# Altium schematic sheet Power.SchDoc
size A4; SheetNumber: 4; SheetTotal: 11
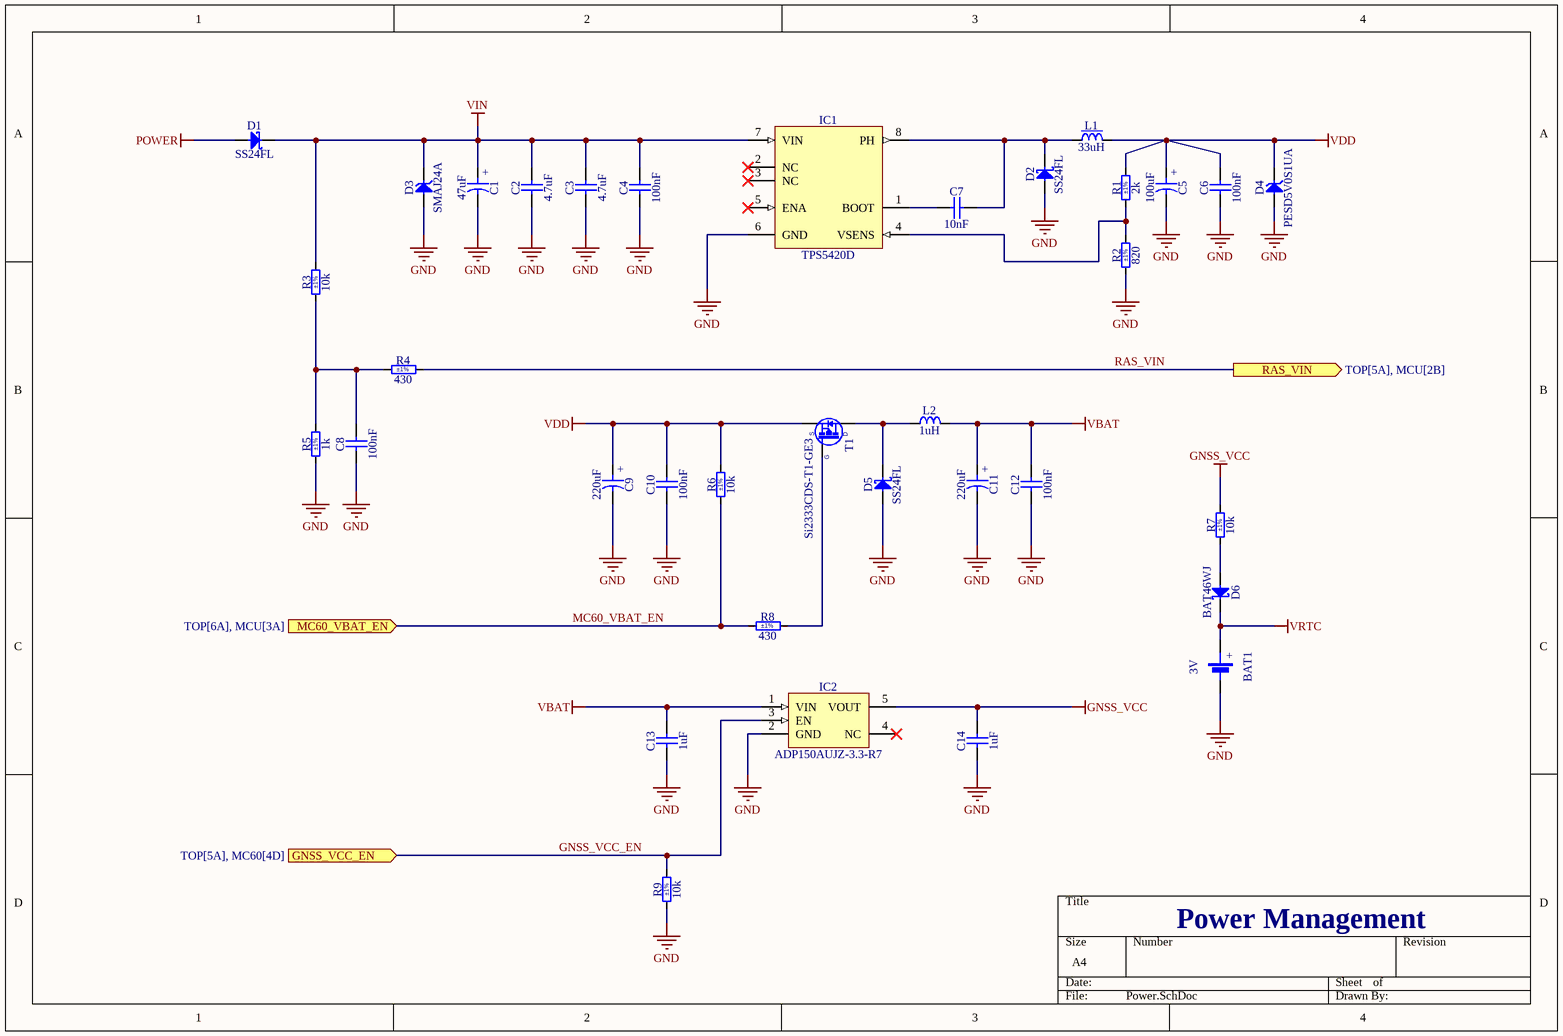
[diagram p0: Power.SchDoc]

## Parts
BAT1  3V  [BAT_SEIKO_ML414H_IV01E]
C1  47uF  [CAPAE660X540N]
C2  4.7uF  [CAPC5750X200N]
C3  4.7uF  [CAPC5750X200N]
C4  100nF  [CAPC1608X90N]
C5  100uF  [CAPMP7343X310N]
C6  100nF  [CAPC1608X87N]
C7  10nF  [CAPC1608X87N]
C8  100nF  [CAPC1608X87N]
C9  220uF  [CAPAE830X620N]
C10  100nF  [CAPC1608X87N]
C11  220uF  [CAPAE830X620N]
C12  100nF  [CAPC1608X87N]
C13  1uF  [CAPC1608X90N]
C14  1uF  [CAPC1608X90N]
D1  SS24FL  [SODFL3617X108N]
D2  SS24FL  [SODFL3617X108N]
D3  SMAJ24A  [DIOM5226X262N]
D4  PESD5V0S1UA  [SOD2512X110N]
D5  SS24FL  [SODFL3617X108N]
D6  BAT46WJ  [SODFL2513X80N]
IC1  TPS5420D  [SOIC127P600X175-8N]
IC2  ADP150AUJZ-3.3-R7  [SOT95P280X90-5N]
L1  33uH  [INDM7066X300N]
L2  1uH  [INDC2520X120N]
R1  2k  Tolerance: ±1%  [RESC1608X55N]
R2  820  Tolerance: ±1%  [RESC1608X55N]
R3  10k  Tolerance: ±1%  [RESC3216X65N]
R4  430  Tolerance: ±1%  [RESC1608X55N]
R5  1k  Tolerance: ±1%  [RESC1608X55N]
R6  10k  Tolerance: ±1%  [RESC1608X55N]
R7  10k  Tolerance: ±1%  [RESC1608X55N]
R8  430  Tolerance: ±1%  [RESC1608X55N]
R9  10k  Tolerance: ±1%  [RESC1608X55N]
T1  Si2333CDS-T1-GE3  [SOT95P237X112-3N]

## Ports
GNSS_VCC_EN (in, see TOP[5A], MC60[4D]), MC60_VBAT_EN (in, see TOP[6A], MCU[3A]), RAS_VIN (out, see TOP[5A], MCU[2B])

## Nets
GND: BAT1.2(MINUS) C1.2 C2.1 C3.1 C4.1 C5.2 C6.1 C8.1 C9.2 C10.1 C11.2 C12.1 C13.1 C14.1 D2.2(A) D3.2(A) D4.2(A) D5.2(A) IC1.6(GND) IC2.2(GND) R2.1 R5.1 R9.1
GNSS_VCC: C14.2 IC2.5(VOUT) R7.2
POWER: D1.2(A)
VBAT: C11.1 C12.2 C13.2 IC2.1(VIN) L2.2
VDD: C5.1 C6.2 C9.1 C10.2 D4.1(C) L1.2 R1.2 R6.2 T1.2(S)
VIN: C1.1 C2.2 C3.2 C4.2 D1.1(C) D3.1(C) IC1.7(VIN) R3.2
VRTC: BAT1.1(PLUS) D6.1(C)
GNSS_VCC_EN: IC2.3(EN) R9.2 ; port GNSS_VCC_EN
MC60_VBAT_EN: R6.1 R8.1 ; port MC60_VBAT_EN
RAS_VIN: R4.2 ; port RAS_VIN
NetC7_1: C7.1 IC1.1(BOOT)
NetC7_2: C7.2 D2.1(C) IC1.8(PH) L1.1
NetC8_2: C8.2 R3.1 R4.1 R5.2
NetD5_1: D5.1(C) L2.1 T1.3(D)
NetD6_2: D6.2(A) R7.1
NetIC1_4: IC1.4(VSENS) R1.1 R2.2
NetR8_2: R8.2 T1.1(G)

Not connected (* = marked no-connect by the designer): IC1 2(NC)* 3(NC)* 5(ENA)*; IC2 4(NC)*

## Notes on the sheet
- Power Management
- (in symbol BAT_SEIKO_ML414H_IV01E) +
- (in symbol CAE660-540_47UF_35V_20%) +
- (in symbol CAE830-620_220UF_10V_20%) +
- (in symbol CTE7343-31_100UF_10V_10%_LESR0050) +

## Library data of the parts
BAT1 = BAT_SEIKO_ML414H_IV01E: Battery 2 Pin; Part Description: Coin, 4.8mm 3 V Lithium Battery Rechargeable (Secondary) 1mAh; Manufacturer: Seiko Instruments; Manufacturer Part Number: ML414H IV01E; PressFit: No; Power: 1mAh; Part Number: BAT_SEIKO_ML414H_IV01E; Component Kind: Standard; Component Type: Standard; Pin Count: 2; PackageDescription: BATTERY LITHIUM 3V RECHARGE; Family: Battery; Mounted: Yes; Socket: No; SMD: Yes; Sense: No; Value: 3V; ComponentHeight: 4.8mm; HelpURL: https://media.digikey.com/PDF/Data%20Sheets/Seiko%20Instruments%20PDFs/ML414H_E.pdf; Author: Xusniyor; CreateDate: 23.04.2023; LatestRevisionDate: 23.04.2023
C1 = CAE660-540_47UF_35V_20%: Polarised capacitor; Part Description: Aluminum Electrolytic SMT Capacitor; Manufacturer: PANASONIC; Manufacturer Part Number: EEEFK1V470AP; Voltage: 35V; Tolerance: ±20%; Part Number: CAE660-540_47UF_35V_20%; Component Kind: Standard; Component Type: Standard; Pin Count: 2; Value: 47uF; Status: Not Recommended; Case: D; Mounted: Yes; Socket: No; SMD: Yes; Sense: No; ComponentHeight: 5.8mm; HelpURL: \\cern.ch\dfs\Applications\Altium\Datasheets\CAE_PANASONIC_FK-V.pdf; Author: CERN DEM JLC; CreateDate: 03.12.2007; LatestRevisionDate: 05.11.2014
C2 C3 = CC2220_4.7UF_100V_10%_X7R: Non-polarised capacitor; Part Description: Multilayer Ceramic Chip Capacitor; Manufacturer: GENERIC; Manufacturer1 Part Number: C5750X7R2A475K230KA; Voltage: 100V; TC: X7R; Tolerance: ±10%; Part Number: CC2220_4.7UF_100V_10%_X7R; Component Kind: Standard; Component Type: Standard; Pin Count: 2; Value: 4.7uF; Status: None; Manufacturer Part Number: CC2220_4.7UF_100V_10%_X7R; Case: 2220; Mounted: Yes; Socket: No; SMD: Yes; Sense: No; Manufacturer1 Example: TDK; Manufacturer1 ComponentHeight: 2.5mm; HelpURL: \\cern.ch\dfs\Applications\Altium\Datasheets\CC2220_X7R_TDK_C_Mid Voltage.pdf; Author: CERN DEM JLC; CreateDate: 31.03.2014; LatestRevisionDate: 30.01.2017
C4 = CC0603_100NF_100V_10%_X7R: Non-polarised capacitor; Part Description: SMD Multilayer Chip Ceramic Capacitor; Manufacturer: GENERIC; Manufacturer1 Part Number: GRM188R72A104KA35D; Voltage: 100V; TC: X7R; Tolerance: ±10%; Part Number: CC0603_100NF_100V_10%_X7R; Component Kind: Standard; Component Type: Standard; Pin Count: 2; Value: 100nF; Status: None; Manufacturer Part Number: CC0603_100NF_100V_10%_X7R; Case: 0603; Mounted: Yes; Socket: No; SMD: Yes; Sense: No; Manufacturer1 Example: MURATA; Manufacturer1 ComponentHeight: 0.9mm; HelpURL: \\cern.ch\dfs\Applications\Altium\Datasheets\CC0603_MURATA_GRM188R72A104KA35D.pdf; Author: CERN DEM JLC; CreateDate: 11.12.2013; LatestRevisionDate: 11.12.2013
C5 = CTE7343-31_100UF_10V_10%_LESR0050: Polarised capacitor; Part Description: Low ESR 0R050 Solid Tantalum Chip Capacitor; Manufacturer: GENERIC; Manufacturer1 Part Number: TPSD107K010R0050; Voltage: 10V; Tolerance: ±10%; Part Number: CTE7343-31_100UF_10V_10%_LESR0050; Component Kind: Standard; Component Type: Standard; Pin Count: 2; Value: 100uF; Status: Preferred; Manufacturer Part Number: CTE7343-31_100UF_10V_10%_LESR0050; Case: D; Mounted: Yes; Socket: No; SMD: Yes; Sense: No; Manufacturer1 Example: AVX; Manufacturer1 ComponentHeight: 3.1mm; HelpURL: \\cern.ch\dfs\Applications\Altium\Datasheets\CTE-LESR_AVX_TPS.pdf; Author: CERN DEM JLC; CreateDate: 05.05.2008; LatestRevisionDate: 20.01.2009
C6 C8 C10 C12 = CC0603_100NF_50V_10%_X7R: Non-polarised capacitor; Part Description: SMD Multilayer Chip Ceramic Capacitor; Manufacturer: GENERIC; Manufacturer1 Part Number: 223858615649; Voltage: 50V; TC: X7R; Tolerance: ±10%; Part Number: CC0603_100NF_50V_10%_X7R; Component Kind: Standard; Component Type: Standard; Pin Count: 2; Value: 100nF; Status: Preferred; Manufacturer Part Number: CC0603_100NF_50V_10%_X7R; Case: 0603; Mounted: Yes; Socket: No; SMD: Yes; Sense: No; Manufacturer1 Example: PHYCOMP; Manufacturer1 ComponentHeight: 0.87mm; HelpURL: \\cern.ch\dfs\Applications\Altium\Datasheets\CC0603_X7R_PHYCOMP.pdf; Author: CERN DEM JLC; CreateDate: 03.12.2007; LatestRevisionDate: 03.12.2007
C7 = CC0603_10NF_50V_10%_X7R: Non-polarised capacitor; Part Description: SMD Multilayer Chip Ceramic Capacitor; Manufacturer: GENERIC; Manufacturer1 Part Number: 223858615636; Voltage: 50V; TC: X7R; Tolerance: ±10%; Part Number: CC0603_10NF_50V_10%_X7R; Component Kind: Standard; Component Type: Standard; Pin Count: 2; Value: 10nF; Status: Preferred; Manufacturer Part Number: CC0603_10NF_50V_10%_X7R; Case: 0603; Mounted: Yes; Socket: No; SMD: Yes; Sense: No; Manufacturer1 Example: PHYCOMP; Manufacturer1 ComponentHeight: 0.87mm; HelpURL: \\cern.ch\dfs\Applications\Altium\Datasheets\CC0603_X7R_PHYCOMP.pdf; Author: CERN DEM JLC; CreateDate: 03.12.2007; LatestRevisionDate: 03.12.2007
C9 C11 = CAE830-620_220UF_10V_20%: Polarised capacitor; Part Description: Aluminum Electrolytic SMT Capacitor; Manufacturer: PANASONIC; Manufacturer Part Number: EEEFK1A221AP; Voltage: 10V; Tolerance: ±20%; Part Number: CAE830-620_220UF_10V_20%; Component Kind: Standard; Component Type: Standard; Pin Count: 2; Value: 220uF; Status: Not Recommended; Case: E; Mounted: Yes; Socket: No; SMD: Yes; Sense: No; ComponentHeight: 6.2mm; HelpURL: \\cern.ch\dfs\Applications\Altium\Datasheets\CAE_PANASONIC_FK-V.pdf; Author: CERN DEM JLC; CreateDate: 03.12.2007; LatestRevisionDate: 05.11.2014
C13 C14 = CC0603_1UF_50V_10%_X7R: Non-polarised capacitor; Part Description: SMD Multilayer Chip Ceramic Capacitor; Manufacturer: GENERIC; Manufacturer1 Part Number: CC0603KRX7R9BB105; Voltage: 50V; TC: X7R; Tolerance: ±10%; Part Number: CC0603_1UF_50V_10%_X7R; Component Kind: Standard; Component Type: Standard; Pin Count: 2; Value: 1uF; Status: None; Manufacturer Part Number: CC0603_1UF_50V_10%_X7R; Case: 0603; Mounted: Yes; Socket: No; SMD: Yes; Sense: No; Manufacturer1 Example: YAGEO PHYCOMP; Manufacturer1 ComponentHeight: 0.9mm; HelpURL: \\cern.ch\dfs\Applications\Altium\Datasheets\CC0603_X7R_PHYCOMP.pdf; Author: CERN DEM BC; CreateDate: 20.08.2020; LatestRevisionDate: 20.08.2020
D1 D2 D5 = SS24FL: Schottky Diode; Part Description: Surface Mount Schottky Barrier Rectifier; Manufacturer: ON SEMICONDUCTOR; Voltage: 40V; Power: 2A; PressFit: No; Bonding: No; Part Number: SS24FL; Component Kind: Standard; Component Type: Standard; Device: SS24FL; PackageDescription: SODFL Diode (SOD123FL); 2.75mm W X 1.72mm L X 1.08mm H body, IPC Medium Density; Manufacturer Part Number: SS24FL; Pin Count: 2; Case: SOD-123FL; Mounted: Yes; Socket: No; SMD: Yes; Sense: No; ComponentHeight: 1.08mm; HelpURL: \\cern.ch\dfs\Applications\Altium\Datasheets\SS24FL.pdf; Author: CERN DEM BC; CreateDate: 06.10.2020; LatestRevisionDate: 06.10.2020
D3 = SMAJ24A: Transient Voltage Suppressor Diode (Uni-Directional); Part Description: Surface Mount Uni-directional Transient Voltage Suppressor Diode; Manufacturer: BOURNS; Voltage: 24V; Power: 400W; PressFit: No; Bonding: No; Part Number: SMAJ24A; Component Kind: Standard; Component Type: Standard; Device: SMAJ24A; PackageDescription: DO-214-AC/SMA Diode, Molded Body; 5.21mm L X 2.605mm W X 2.62mm H, IPC Medium Density; Manufacturer Part Number: SMAJ24A; Pin Count: 2; Case: DO-214AC; Mounted: Yes; Socket: No; SMD: Yes; Sense: No; ComponentHeight: 2.62mm; HelpURL: \\cern.ch\dfs\Applications\Altium\Datasheets\SMAJ24A.pdf; Author: CERN DEM JLC; CreateDate: 27.06.2011; LatestRevisionDate: 27.06.2011
D4 = PESD5V0S1UA: Transient Voltage Suppressor Diode (Uni-Directional); Part Description: Unidirectional ESD Protection for Transient Voltage Suppression; Manufacturer: NXP SEMICONDUCTORS; Voltage: 5V; Power: 890W; PressFit: No; Bonding: No; Part Number: PESD5V0S1UA; Component Kind: Standard; Component Type: Standard; Device: PESD5V0S1UA; PackageDescription: Small Outline Diode (SOD-323), 1.70mm W X 1.25mm L X 1.10mm H body,  IPC Medium Density; Manufacturer Part Number: PESD5V0S1UA; Pin Count: 2; Case: SOD323; Mounted: Yes; Socket: No; SMD: Yes; Sense: No; ComponentHeight: 1.1mm; HelpURL: \\cern.ch\dfs\Applications\Altium\Datasheets\PESD5V0S1UA.pdf; Author: CERN DEM JLC; CreateDate: 28.08.2012; LatestRevisionDate: 18.09.2013
D6 = BAT46WJ: Schottky Diode; Part Description: Single Schottky Barrier Diode; Manufacturer: NEXPERIA; Voltage: 100V; Power: 250mA; PressFit: No; Bonding: No; Part Number: BAT46WJ; Component Kind: Standard; Component Type: Standard; Device: BAT46WJ; PackageDescription: SODFL Diode (SOD323F); 1.70mm W X 1.25mm L X 0.80mm H body, IPC Medium Density; Manufacturer Part Number: BAT46WJ; Pin Count: 2; Case: SOD-323F; Mounted: Yes; Socket: No; SMD: Yes; Sense: No; ComponentHeight: 0.8mm; HelpURL: \\cern.ch\dfs\Applications\Altium\Datasheets\BAT46WJ.pdf; Author: CERN DEM JLC; CreateDate: 18.01.2018; LatestRevisionDate: 18.01.2018
IC1 = TPS5420D: 2A, Wide Input Range, Step-Down SWIFT Converter; Manufacturer: TEXAS INSTRUMENTS; PressFit: No; Bonding: No; Part Number: TPS5420D; Component Kind: Standard; Component Type: Standard; Device: TPS5420D; PackageDescription: SOIC 8, Pitch 1.27mm, Body 4x5mm, IPC Medium Density; Part Description: 2A, Wide Input Range, Step-Down SWIFT Converter; Manufacturer Part Number: TPS5420D; Pin Count: 8; Case: SOIC8; Mounted: Yes; Socket: No; SMD: Yes; Sense: No; ComponentHeight: 1.75mm; HelpURL: \\cern.ch\dfs\Applications\Altium\Datasheets\TPS5420D.pdf; Author: CERN DEM JLC; CreateDate: 17.11.2009; LatestRevisionDate: 07.12.2011
IC2 = ADP150AUJZ-3.3-R7: Ultralow Noise, 150 mA CMOS Linear Regulator; Part Description: 3.3V, 150mA, Ultralow Noise, CMOS Linear Regulator; Manufacturer: ANALOG DEVICES; PressFit: No; Bonding: No; Part Number: ADP150AUJZ-3.3-R7; Component Kind: Standard; Component Type: Standard; Device: ADP150AUJZ-3.3-R7; PackageDescription: SOT23, 0.95mm pitch; 5 pin, 1.75mm W X 3.00mm L, IPC Medium Density; Manufacturer Part Number: ADP150AUJZ-3.3-R7; Pin Count: 5; Case: SOT23; Mounted: Yes; Socket: No; SMD: Yes; Sense: No; ComponentHeight: 0.9mm; HelpURL: \\cern.ch\dfs\Applications\Altium\Datasheets\ADP150AUJZ-3.3-R7.pdf; Author: CERN DEM JLC; CreateDate: 27.09.2011; LatestRevisionDate: 19.06.2014
L1 = IND_33UH_20%_FXL0630-330-M: Inductor With Core; Part Description: 2A 33uH ±20% 2.5A SMD,6.6x7mm Power Inductors ROHS; Manufacturer: Changjiang Microelectronics Tech; Power: 2A; Resistance: 0.280R; Tolerance: ±20%; Part Number: IND_33UH_20%_FXL0630-330-M; Component Kind: Standard; Component Type: Standard; Pin Count: 2; Value: 33uH; Manufacturer Part Number: FXL0630-330-M; Case: 6.6x7; Mounted: Yes; Socket: No; SMD: Yes; Sense: No; ComponentHeight: 2.8mm; HelpURL: https://datasheet.lcsc.com/lcsc/1810111121_cjiang--Changjiang-Microelectronics-Tech-FXL0630-330-M_C177245.pdf; Author: Xusniyor; CreateDate: 01.05.2023; LatestRevisionDate: 01.05.2023
L2 = IND1008_1UH_20%_MURATA_DFE252012P-1R0M=P2: Inductor; Part Description: 1 µH Shielded Drum Core, Wirewound Inductor 4.3 A 42mOhm Max 1008 (2520 Metric); Manufacturer: MURATA; Power: 4.3A; Resistance: 0.042A; Tolerance: ±20%; Part Number: IND1008_1UH_20%_MURATA_DFE252012P-1R0M=P2; Component Kind: Standard; Component Type: Standard; Pin Count: 2; Value: 1uH; Manufacturer Part Number: DFE252012P-1R0M=P2; Case: 1008; Mounted: Yes; Socket: No; SMD: Yes; Sense: No; ComponentHeight: 1.2mm; HelpURL: https://www.murata.com/~/media/webrenewal/products/inductor/chip/tokoproducts/wirewoundmetalalloychiptype/m_dfe252012p.ashx; Author: Xusniyor; CreateDate: 12.02.2023; LatestRevisionDate: 12.02.2023
R1 = R0603_2K_1%_0.1W_100PPM: Resistor - 1%; Part Description: General Purpose Thick Film Chip Resistor; Manufacturer: GENERIC; Manufacturer1 Part Number: NRC06F2001TRF; Power: 0.1W; TC: ±100ppm/°C; PressFit: No; Part Number: R0603_2K_1%_0.1W_100PPM; Component Kind: Standard; Component Type: Standard; Pin Count: 2; Value: 2k; Status: Preferred; Manufacturer Part Number: R0603_2K_1%_0.1W_100PPM; Case: 0603; Mounted: Yes; Sense: No; Socket: No; SMD: Yes; Manufacturer1 Example: NIC COMPONENT; Manufacturer1 ComponentHeight: 0.55mm; HelpURL: \\cern.ch\dfs\Applications\Altium\Datasheets\R0603_NIC_NRC.pdf; Author: CERN DEM JLC; CreateDate: 03.12.2007; LatestRevisionDate: 13.03.2008
R2 = R0603_820R_1%_0.1W_100PPM: Resistor - 1%; Part Description: General Purpose Thick Film Chip Resistor; Manufacturer: GENERIC; Manufacturer1 Part Number: NRC06F8200TRF; Power: 0.1W; TC: ±100ppm/°C; PressFit: No; Part Number: R0603_820R_1%_0.1W_100PPM; Component Kind: Standard; Component Type: Standard; Pin Count: 2; Value: 820; Status: Preferred; Manufacturer Part Number: R0603_820R_1%_0.1W_100PPM; Case: 0603; Mounted: Yes; Sense: No; Socket: No; SMD: Yes; Manufacturer1 Example: NIC COMPONENT; Manufacturer1 ComponentHeight: 0.55mm; HelpURL: \\cern.ch\dfs\Applications\Altium\Datasheets\R0603_NIC_NRC.pdf; Author: CERN DEM JLC; CreateDate: 03.12.2007; LatestRevisionDate: 13.03.2008
R3 = R1206_10K_1%_0.25W_100PPM: Resistor - 1%; Part Description: General Purpose Thick Film Chip Resistor; Manufacturer: GENERIC; Manufacturer1 Part Number: NRC12F1002TRF; Power: 0.25W; TC: ±100ppm/°C; PressFit: No; Part Number: R1206_10K_1%_0.25W_100PPM; Component Kind: Standard; Component Type: Standard; Pin Count: 2; Value: 10k; Status: Preferred; Manufacturer Part Number: R1206_10K_1%_0.25W_100PPM; Case: 1206; Mounted: Yes; Sense: No; Socket: No; SMD: Yes; Manufacturer1 Example: NIC COMPONENT; Manufacturer1 ComponentHeight: 0.65mm; HelpURL: \\cern.ch\dfs\Applications\Altium\Datasheets\R1206_NIC_NRC.pdf; Author: CERN DEM JLC; CreateDate: 03.12.2007; LatestRevisionDate: 13.03.2008
R4 R8 = R0603_430R_1%_0.1W_100PPM: Resistor - 1%; Part Description: General Purpose Thick Film Chip Resistor; Manufacturer: GENERIC; Manufacturer1 Part Number: NRC06F4300TRF; Power: 0.1W; TC: ±100ppm/°C; PressFit: No; Part Number: R0603_430R_1%_0.1W_100PPM; Component Kind: Standard; Component Type: Standard; Pin Count: 2; Value: 430; Status: Preferred; Manufacturer Part Number: R0603_430R_1%_0.1W_100PPM; Case: 0603; Mounted: Yes; Sense: No; Socket: No; SMD: Yes; Manufacturer1 Example: NIC COMPONENT; Manufacturer1 ComponentHeight: 0.55mm; HelpURL: \\cern.ch\dfs\Applications\Altium\Datasheets\R0603_NIC_NRC.pdf; Author: CERN DEM JLC; CreateDate: 03.12.2007; LatestRevisionDate: 13.03.2008
R5 = R0603_1K_1%_0.1W_100PPM: Resistor - 1%; Part Description: General Purpose Thick Film Chip Resistor; Manufacturer: GENERIC; Manufacturer1 Part Number: NRC06F1001TRF; Power: 0.1W; TC: ±100ppm/°C; PressFit: No; Part Number: R0603_1K_1%_0.1W_100PPM; Component Kind: Standard; Component Type: Standard; Pin Count: 2; Value: 1k; Status: Preferred; Manufacturer Part Number: R0603_1K_1%_0.1W_100PPM; Case: 0603; Mounted: Yes; Sense: No; Socket: No; SMD: Yes; Manufacturer1 Example: NIC COMPONENT; Manufacturer1 ComponentHeight: 0.55mm; HelpURL: \\cern.ch\dfs\Applications\Altium\Datasheets\R0603_NIC_NRC.pdf; Author: CERN DEM JLC; CreateDate: 03.12.2007; LatestRevisionDate: 13.03.2008
R6 R7 R9 = R0603_10K_1%_0.1W_100PPM: Resistor - 1%; Part Description: General Purpose Thick Film Chip Resistor; Manufacturer: GENERIC; Manufacturer1 Part Number: NRC06F1002TRF; Power: 0.1W; TC: ±100ppm/°C; PressFit: No; Part Number: R0603_10K_1%_0.1W_100PPM; Component Kind: Standard; Component Type: Standard; Pin Count: 2; Value: 10k; Status: Preferred; Manufacturer Part Number: R0603_10K_1%_0.1W_100PPM; Case: 0603; Mounted: Yes; Sense: No; Socket: No; SMD: Yes; Manufacturer1 Example: NIC COMPONENT; Manufacturer1 ComponentHeight: 0.55mm; HelpURL: \\cern.ch\dfs\Applications\Altium\Datasheets\R0603_NIC_NRC.pdf; Author: CERN DEM JLC; CreateDate: 03.12.2007; LatestRevisionDate: 13.03.2008
T1 = Si2333CDS-T1-GE3: P-CHANNEL MOSFET WITH DIODE; Part Description: -12V -5.1A P-Channel  TrenchFET® Power MOSFET; Manufacturer: VISHAY SILICONIX; PressFit: No; Bonding: No; Part Number: Si2333CDS-T1-GE3; Component Kind: Standard; Component Type: Standard; Device: Si2333CDS-T1-GE3; PackageDescription: SOT23, 0.95mm Pitch; 3 Pin, 1.30mm W X 2.92mm L X 1.12mm H body, IPC Medium Density; Manufacturer Part Number: Si2333CDS-T1-GE3; Pin Count: 3; Case: SOT23-3; Mounted: Yes; Socket: No; SMD: Yes; Sense: No; ComponentHeight: 1.12mm; HelpURL: \\cern.ch\dfs\Applications\Altium\Datasheets\Si2333CDS-T1-GE3.pdf; Author: CERN DEM JLC; CreateDate: 03.03.2011; LatestRevisionDate: 02.05.2011